# Altium schematic sheet HEATSINK_FAN.SchDoc: HEATSINK FAN
size A3; Author: Silvio Navaretti; CompanyName: ARDUINO; DrawnBy: Silvio Navaretti; Engineer: Silvio Navaretti; Organization: ARDUINO; SheetNumber: 50; SheetTotal: 51; RevAuthor: Silvio Navaretti
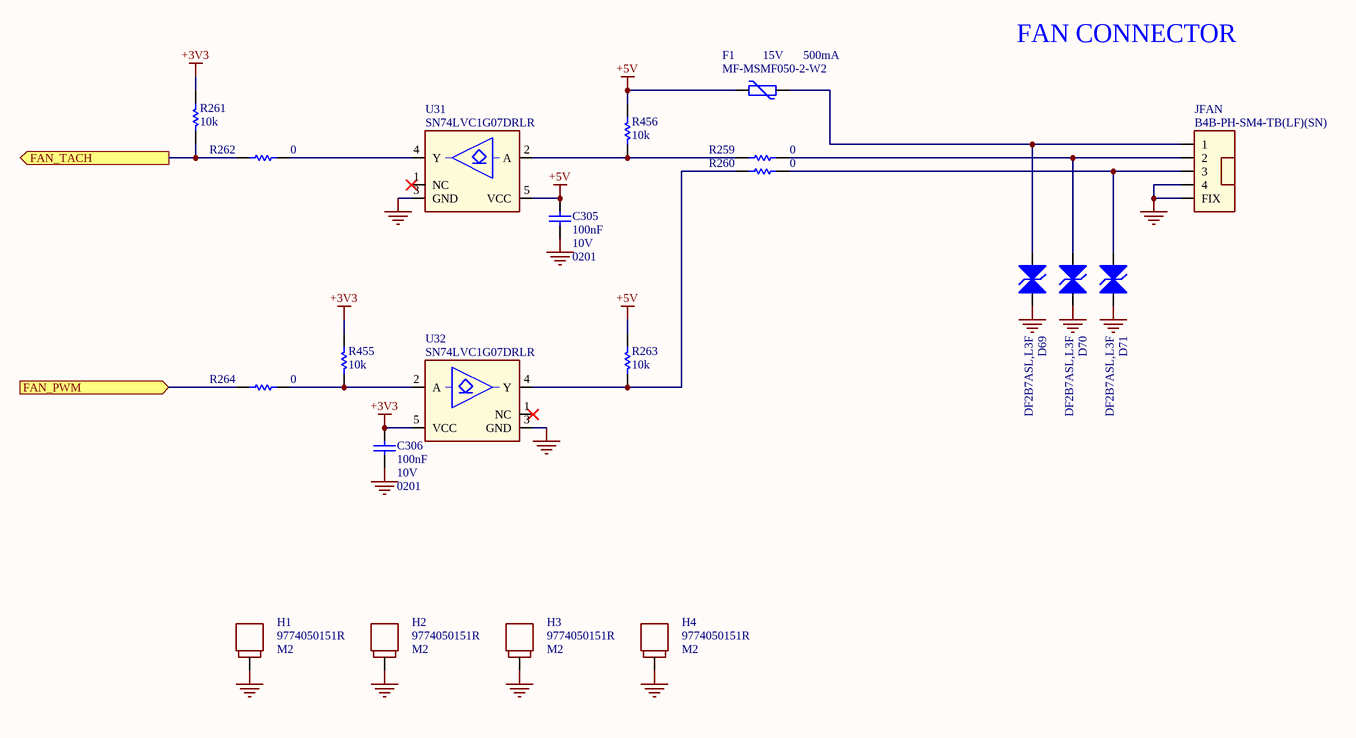
[diagram p0: HEATSINK_FAN.SchDoc]

## Parts
C305  value 100nF  Voltage: 10V  Case Code (Imperial): 0201  [CAP-0201]  (hidden comment: CL03A104KP3NNNC)
C306  value 100nF  Voltage: 10V  Case Code (Imperial): 0201  [CAP-0201]  (hidden comment: CL03A104KP3NNNC)
D69  DF2B7ASL,L3F  [DF2B7ASL,L3F]
D70  DF2B7ASL,L3F  [DF2B7ASL,L3F]
D71  DF2B7ASL,L3F  [DF2B7ASL,L3F]
F1  MF-MSMF050-2-W2  Hold Current: 500mA  Operating Supply Voltage: 15V  [1812]
H1  9774050151R  [9774050151R]
H2  9774050151R  [9774050151R]
H3  9774050151R  [9774050151R]
H4  9774050151R  [9774050151R]
JFAN  B4B-PH-SM4-TB(LF)(SN)  [B4B-PH-SM4-TB(LF)(SN)]
R259  value 0  [RES-0201]  (hidden comment: CRCW02010000Z0ED)
R260  value 0  [RES-0201]  (hidden comment: CRCW02010000Z0ED)
R261  value 10k  [RES-0201]  (hidden comment: RC0201FR-0710KL)
R262  value 0  [RES-0201]  (hidden comment: CRCW02010000Z0ED)
R263  value 10k  [RES-0201]  (hidden comment: RC0201FR-0710KL)
R264  value 0  [RES-0201]  (hidden comment: CRCW02010000Z0ED)
R455  value 10k  [RES-0201]  (hidden comment: RC0201FR-0710KL)
R456  value 10k  [RES-0201]  (hidden comment: RC0201FR-0710KL)
U31  SN74LVC1G07DRLR  [TI DRL DRL0005A]
U32  SN74LVC1G07DRLR  [TI DRL DRL0005A]

## Ports
FAN_PWM (in), FAN_TACH (out)

## Nets
+3V3: C306.2 R261.2 R455.2 U32.5(VCC)
+5V: C305.2 F1.1 R263.2 R456.2 U31.5(VCC)
GND: C305.1 C306.1 D69.1(A1) D70.1(A1) D71.1(A1) H1.1 H2.1 H3.1 H4.1 JFAN.4 JFAN.FIX U31.3(GND) U32.3(GND)
FAN_PWM: R264.2 ; port FAN_PWM
FAN_TACH: R261.1 R262.2 ; port FAN_TACH
NetD69_2: D69.2(A2) F1.2 JFAN.1
NetD70_2: D70.2(A2) JFAN.2 R259.1
NetD71_2: D71.2(A2) JFAN.3 R260.1
NetR259_2: R259.2 R456.1 U31.2(A)
NetR260_2: R260.2 R263.1 U32.4(Y)
NetR262_1: R262.1 U31.4(Y)
NetR264_1: R264.1 R455.1 U32.2(A)

Not connected (* = marked no-connect by the designer): U31 1(NC)*; U32 1(NC)*

## Notes on the sheet
- FAN CONNECTOR
- Title:
- ID:
- Date:
- Time:
- Version:
- Sheet
- of
- RevAuthor:
- Reference Designs ARE PROVIDED "AS IS" AND "WITH ALL FAULTS. Arduino SA DISCLAIMS ALL OTHER WARRANTIES, EXPRESS OR IMPLIED, REGARDING PRODUCTS, INCLUDING BUT NOT LIMITED TO, ANY IMPLIED WARRANTIES OF MERCHANTABILITY OR FITNESS FOR A PARTICULAR PURPOSE.
  Arduino SA may make changes to specifications and product descriptions at any time, without notice. The Customer must not rely on the absence or characteristics of any features or instructions marked "reserved" or "undefined".
  Arduino SA reserves these for future definition and shall have no responsibility whatsoever for conflicts or incompatibilities arising from future changes to them. The product information on the Web Site or Materials is subject to change without notice.
  Do not finalize a design with this info. ARDUINO and other Arduino brands and logos and Trademarks of Arduino SA. All Arduino SA Trademarks cannot be used without owner's formal permission.
- File:
- Author:
- (in symbol S0005-A.6) M2

## Library data of the parts
C305 C306 = C0113-A.6: CAP CHIP 0201 100nF 10% 10V X5R; Manufacturer: Samsung Electro-Mechanics; Code Arduino: C0113; Technology: Ceramic; Part Number: CL03A104KP3NNNC; Dielectric: X5R; Tolerance: 10%
D69-D71 = D0099-5: TVS BIDIRECTIONAL SMD Vr 5.5V, Vbr min 5.8V, 0.62x0.32mm; Manufacturer: TOSHIBA; Vforward max: 0V; Ireverse max: 1µA; Power max: 80W; Code Arduino: D0099; Vreverse max: 20V; V(BR) min: 5.8V; V(RWM) max: 5.5V; Part Number: DF2B7ASL,L3F
F1 = P0002-A.7: PTC RESET FUSE 15V 500MA 1812 LOGO OO ARDUINO; Manufacturer: Bourns; Approvals: UL,CSA,TUV; Time to Trip: 0.15s; Max Current Rating: 100A; Trip Current: 1A; Resistance: 150mR; Code Arduino: 3335; Power Dissipation: 800mW; Part Number: MF-MSMF050-2-W2; Contact Plating: Gold; Case Code (Metric): 4532; Min Operating Temperature: -40°C; Packaging: Tape and Reel; Max Operating Temperature: 85°C; Radiation Hardening: No; Voltage Rating (DC): 15V; Termination: SMD/SMT; Number of Terminals: 2; Terminal Material: Gold; Voltage Rating: 15V; Width: 3.41mm; Case Code (Imperial): 1812; Length: 4.73mm; Current Rating: 100A; REACH SVHC: No SVHC; Package Quantity: 2000; Lead Free: Lead Free; Case/Package: 1812; Height: 0.85mm; Mount: Surface Mount,PCB
H1-H4 = S0005-A.6: M2.5 SPACER SMT ROUND STEEL H=5mm; Manufacturer: Würth Elektronik; Code Arduino: S0005; Part Number: 9774050151R
JFAN = J0557-A.2: CONN Header SMD 1x4 vertical polarized; Manufacturer: JST; Code Arduino: J0557; Part Number: B4B-PH-SM4-TB(LF)(SN)
R259 R260 R262 R264 = R0140-A.21: RES CHIP 0201 0R; Manufacturer: Vishay; Temperature coefficient: 0ppm; Code Arduino: R0140; Power: 50mW; Tolerance: 0%; Technology: Thick film; Case Code (Imperial): 0201; Part Number: CRCW02010000Z0ED
R261 R263 R455 R456 = R0145-A.21: RES CHIP 0201 10k 1% 1/20W; Manufacturer: Yageo; Power: 50mW; Temperature coefficient: 200ppm; Code Arduino: R0145; Manufacturer 2: Samsung Electro-Mechanics; Tolerance: 1%; Case Code (Imperial): 0201; Part Number: RC0201FR-0710KL; Technology: Thick film
U31 U32 = U0494-A.2: IC buffer open drain, 1.65V to 5.5V, 32mA sink current, SOT-5X3 1.6mmx1.6mm; Manufacturer: Texas Instruments; Code Arduino: U0494; Part Number: SN74LVC1G07DRLR